# Altium schematic sheet Connectors.SchDoc
size A4; SheetNumber: 5; SheetTotal: 6
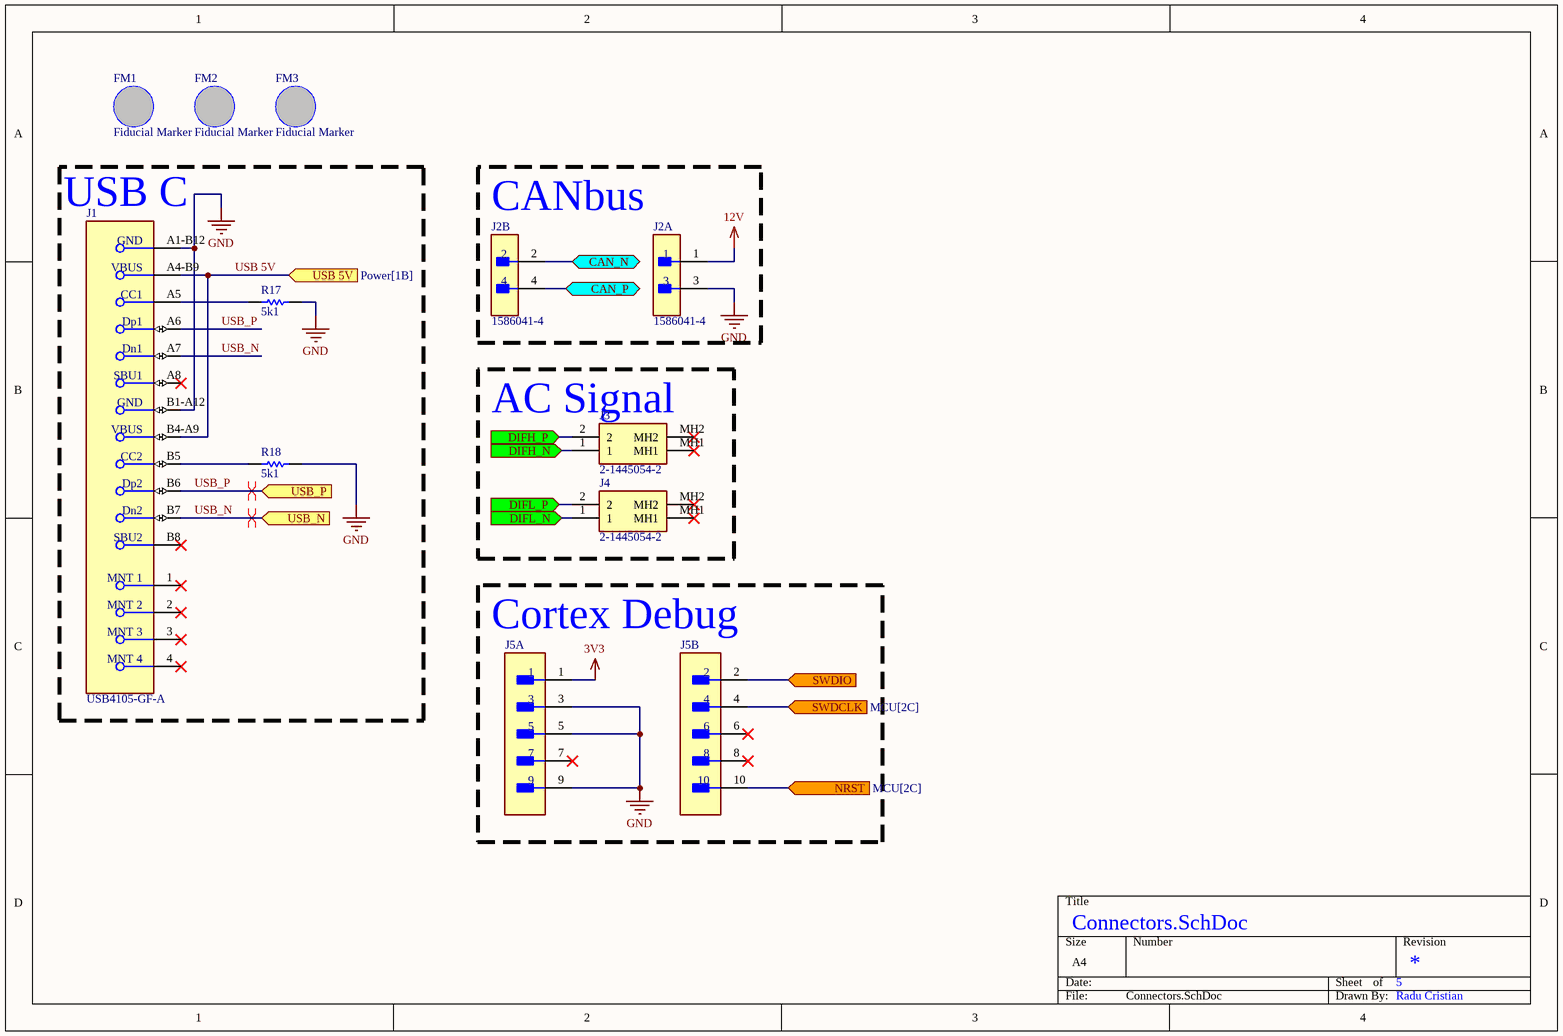
[diagram p0: Connectors.SchDoc]

## Parts
FM1  Fiducial Marker  [Fiducial Marker-Footprint-1]
FM2  Fiducial Marker  [Fiducial Marker-Footprint-1]
FM3  Fiducial Marker  [Fiducial Marker-Footprint-1]
J1  USB4105-GF-A  [FP-USB4105-GF-A-MFG]
J2  1586041-4  [FP-1586041-4-MFG]  (parts A,B of 2)
J3  2-1445054-2  [214450542]
J4  2-1445054-2  [214450542]
J5  FTSH-105-01-L-DV-K-P-TR  [FP-FTSH-105-01-L-DV-K-P-T-MFG]  (value not drawn)  (parts A,B of 2)
R17  Parameter 1: 5k1  [RESC2013X60X30NL20T20]  (hidden comment: RK73H2ATTD5101F)
R18  Parameter 1: 5k1  [RESC2013X60X30NL20T20]  (hidden comment: RK73H2ATTD5101F)

## Blocks framed on the sheet
USB C: J1 R17 R18
CANbus: J2
AC Signal: J3 J4
Cortex Debug: J5

## Ports
CAN_N (bidir, see Communication[2D]), CAN_P (bidir, see Communication[2C]), DIFH_N (in, see Communication[2B]), DIFH_P (in, see Communication[2A]), DIFL_N (in, see Communication[2C]), DIFL_P (in, see Communication[2B]), NRST (in, see MCU[2C]), SWDCLK (in, see MCU[2C]), SWDIO (in, see MCU[2C]), USB 5V (in, see Power[1B]), USB_N (in, see MCU[2B]), USB_P (in, see MCU[2B])

## Nets
3V3: J5.1
12V: J2.1
GND: J1.A1-B12(GND) J1.B1-A12(GND) J2.3 J5.3 J5.5 J5.9 R17.1 R18.1
CAN_N: J2.2 ; port CAN_N
CAN_P: J2.4 ; port CAN_P
DIFH_N: J3.1 ; port DIFH_N
DIFH_P: J3.2 ; port DIFH_P
DIFL_N: J4.1 ; port DIFL_N
DIFL_P: J4.2 ; port DIFL_P
NRST: J5.10 ; port NRST
SWDCLK: J5.4 ; port SWDCLK
SWDIO: J5.2 ; port SWDIO
USB 5V: J1.A4-B9(VBUS) J1.B4-A9(VBUS) ; port USB 5V
USB_N: J1.A7(Dn1) J1.B7(Dn2) ; port USB_N
USB_P: J1.A6(Dp1) J1.B6(Dp2) ; port USB_P
NetJ1_A5: J1.A5(CC1) R17.2
NetJ1_B5: J1.B5(CC2) R18.2

Not connected (* = marked no-connect by the designer): J1 1(MNT_1)* 2(MNT_2)* 3(MNT_3)* 4(MNT_4)* A8(SBU1)* B8(SBU2)*; J3 MH1* MH2*; J4 MH1* MH2*; J5 6* 7* 8*

## Layout directives
differential pair: USB_N, USB_P

## Notes on the sheet
- Radu Cristian

## Library data of the parts
FM1-FM3 = CMP-00003-4: fancy style
J1 = CMP-245163-000001-1: CONN RCPT USB2.0 TYPEC 5A; Manufacturer: GCT; Voltage Rating: 20V; Is Female: yes; Current Rating: 5/6.25/1.25/0.25A; Number Of Contacts: 16; Conn Orientation: Right Angle; Device Class L1: Connectors; Category: Conn; Lead Free: Yes; RoHS: TRUE; Temperature Range High: +85°C; Digikey Description: CONN RCPT USB2.0 TYPEC 5A; Device Class L3: unset; ComponentLink2Description: Datasheet; Manufacturer Part Number: USB4105-GF-A; Package: 0; Usb Standard: USB 2.0; Device Class L2: USB Connectors; Automotive: No; Temperature Range Low: -40°C; Height: 3.46mm; Temperature: -40°C to +85°C; Contact Material: Gold,Nickel; ComponentLink2URL: https://gct.co/files/drawings/usb4105.pdf; Octopart: https://octopart.com/usb4105-gf-a-gct-106627878
J2 = CMP-03369-000045-1: CONN HEADER R/A 4POS 4.2MM; Manufacturer: TE; Standoff Height: 0.4mm; Conn Gender: Male; Current Rating: 9A; Voltage Rating: 600V; Number Of Contacts: 4; Conn Orientation: Right Angle; Footprint Url: https://www.te.com/commerce/DocumentDelivery/DDEController?Action=showdoc&DocId=Customer+Drawing%7F1586041%7FB5%7Fpdf%7FEnglish%7FENG_CD_1586041_B5.pdf%7F1586041-4; Digikey Description: CONN HEADER R/A 4POS 4.2MM; Category: Conn; ComponentLink2URL: https://www.te.com/commerce/DocumentDelivery/DDEController?Action=showdoc&DocId=Specification+Or+Standard%7F108-2112%7FD2%7Fpdf%7FEnglish%7FENG_SS_108-2112_D2.pdf%7F1586041-8; Temperature: -40°C to +105°C; Lead Free: Yes; ComponentLink2Description: Datasheet; Pitch: 4.2mm; Number Of Rows: 2; Manufacturer Part Number: 1586041-4; Octopart: https://octopart.com/1586041-4-te+connectivity-46506786; Mouser Description: Header; Conn; Wire to Wire & Wire to Board; PCB Plug; 4 Cont; Solder; PE Series; 9A; Contact Material: Tin,Nickel; Package: 1586041-4; Device Class L1: Connectors; RoHS: TRUE; Temperature Range High: +105°C; Temperature Range Low: -40°C; Device Class L2: Headers and Wire Housings; Device Class L3: unset; Automotive: No
J3 J4 = 2-1445054-2: Connector; Manufacturer_Name: TE Connectivity; Datasheet Link: https://www.te.com/commerce/DocumentDelivery/DDEController?Action=srchrtrv&DocNm=micro-mate-n-lok-connector-qrg&DocType=Data%20Sheet&DocLang=English&PartCntxt=2-1445054-2&DocFormat=pdf; Height: 5.87mm; Manufacturer_Part_Number: 2-1445054-2; Mouser Part Number: 571-2-1445054-2; Mouser Price/Stock: https://www.mouser.co.uk/ProductDetail/TE-Connectivity-AMP/2-1445054-2?qs=FMZNX9%2FJjogUaikf%252BrNkUw%3D%3D; Arrow Part Number: 2-1445054-2; Arrow Price/Stock: https://www.arrow.com/en/products/2-1445054-2/te-connectivity?region=nac
J5 = CMP-2000-06292-2: CONN HEADER SMD 10POS 1.27MM; Gender: Male; Max Current Rating: 1.75A; Number of Contacts: 10; Contact Material: Bronze; Pitch: 1.27mm; Contact Plating: Gold; Orientation: Straight; RoHS Compliant: Yes; Housing Material: Polymer; Housing Color: Black; Length: 6.35mm; Number of Rows: 2; Lead Free: Lead Free; Max Operating Temperature: 125°C; Min Operating Temperature: -55°C; Radiation Hardening: No; Termination: Solder; Depth: 5.84mm; Packaging: Tape and Reel
R17 R18 = CMP-2001-02431-1: Manufacturer: KOA Speer; Part Number: RK73H2ATTD5101F